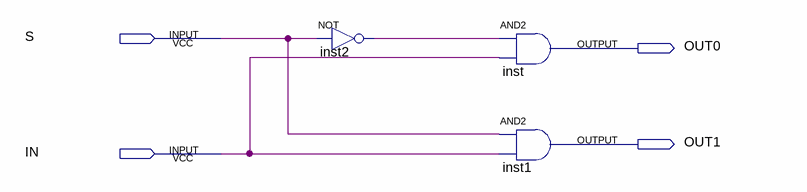
[diagram p0: schematic sheet]
// Quartus schematic DMX12.bdf as structural Verilog: 3 symbols, 4 pins
module DMX12 (
  input  S,
  input  IN,
  output OUT0,
  output OUT1
);

  wire inst2_out;

  not inst2 (inst2_out, S);
  and inst (OUT0, inst2_out, IN);
  and inst1 (OUT1, S, IN);
endmodule
